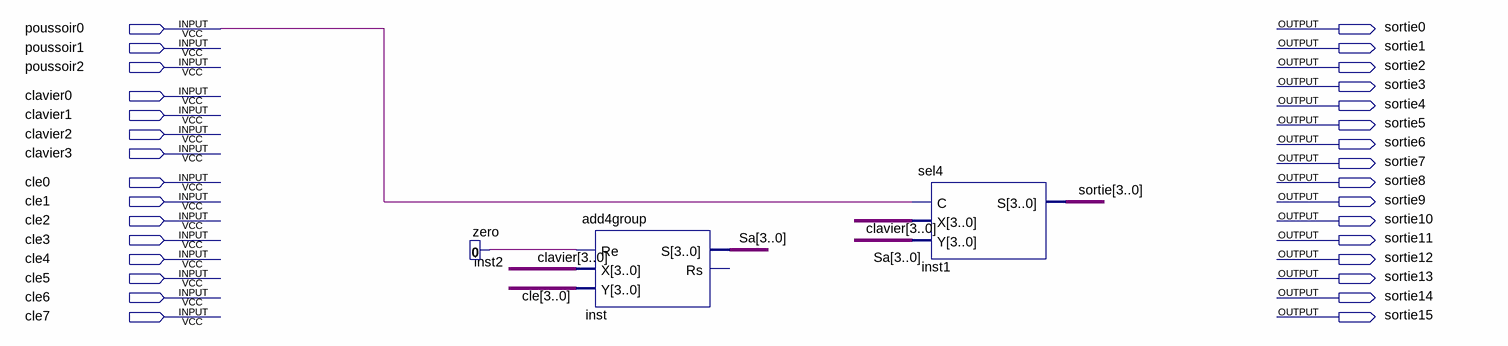
[diagram p0: schematic sheet]
// Quartus schematic fpga1.bdf as structural Verilog: 3 symbols, 31 pins
module fpga1 (
  input  poussoir0,
  input  poussoir1,
  input  poussoir2,
  input  clavier0,
  input  clavier1,
  input  clavier2,
  input  clavier3,
  input  cle0,
  input  cle1,
  input  cle2,
  input  cle3,
  input  cle4,
  input  cle5,
  input  cle6,
  input  cle7,
  output sortie0,
  output sortie1,
  output sortie2,
  output sortie3,
  output sortie4,
  output sortie5,
  output sortie6,
  output sortie7,
  output sortie8,
  output sortie9,
  output sortie10,
  output sortie11,
  output sortie12,
  output sortie13,
  output sortie14,
  output sortie15
);

  wire inst2_0;
  wire [3:0] Sa;

  zero inst2 (.\0 (inst2_0));
  add4group inst (
    .Re(inst2_0), .X({clavier3, clavier2, clavier1, clavier0}), .Y({cle3, cle2, cle1, cle0}), .S(Sa));  // open: Rs
  sel4 inst1 (
    .C(poussoir0), .X({clavier3, clavier2, clavier1, clavier0}), .Y(Sa),
    .S({sortie3, sortie2, sortie1, sortie0}));
endmodule
